# EAGLE design TPS22810_breakout (EAGLE 6.6.0)
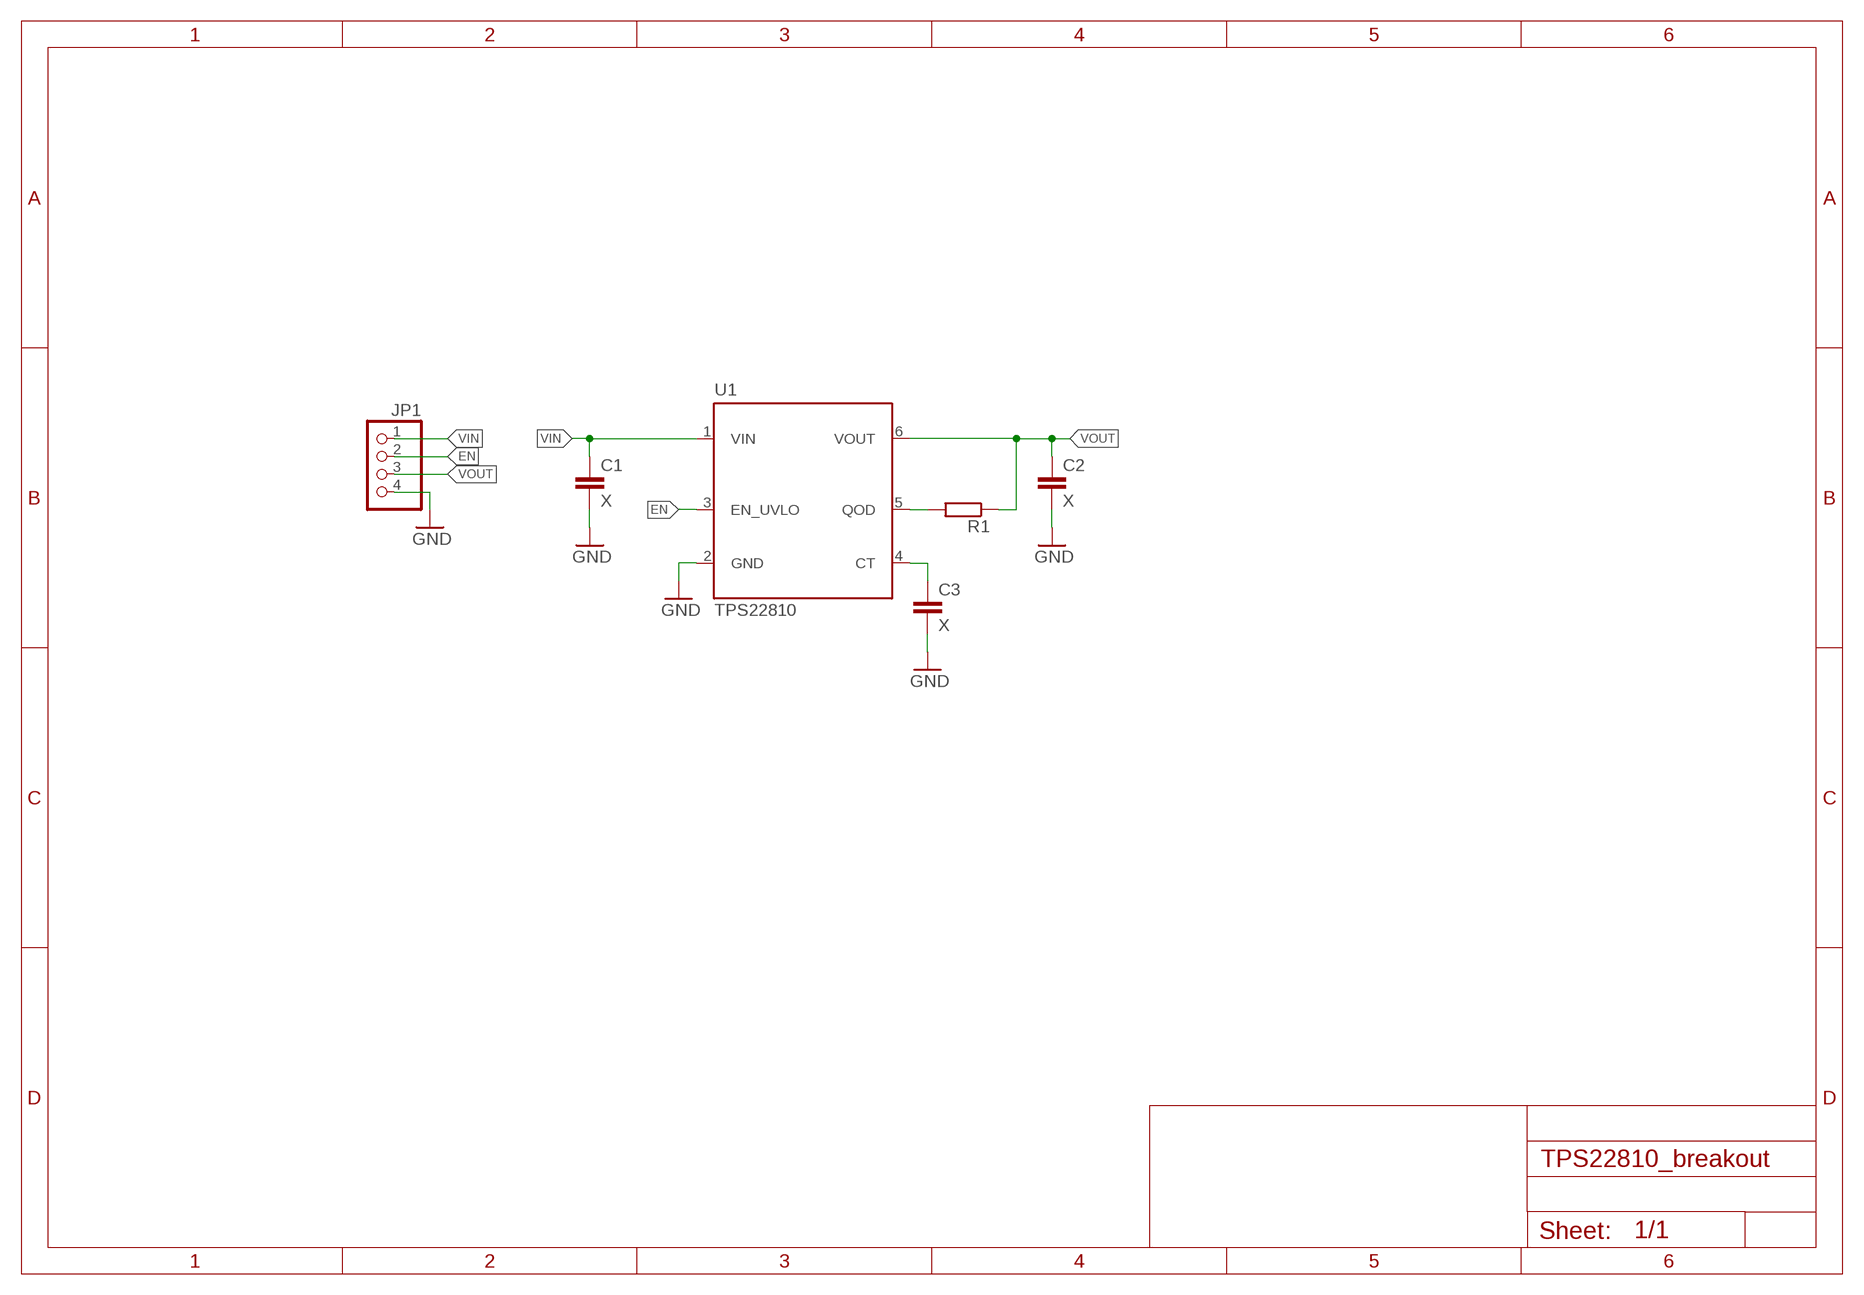
[diagram p0: schematic, sheet 1]

## Parts
C1  X  C-EU0603  [C0603]
C2  X  C-EU0603  [C0603]
C3  X  C-EU0603  [C0603]
JP1  PINHD-1X4  [1X04]
R1  R-EU_R0603  [R0603]
U1  TPS22810  [DBV-R-PDSO-G6]

## Nets
EN: JP1.2 U1.3(EN_UVLO)
GND: C1.2 C2.2 C3.2 JP1.4 U1.2(GND)
N$2: R1.2 U1.5(QOD)
N$3: C3.1 U1.4(CT)
VIN: C1.1 JP1.1 U1.1(VIN)
VOUT: C2.1 JP1.3 R1.1 U1.6(VOUT)

## Library data of the parts
C1-C3 = usr_gerneral:C-EU; DISTRIBUTOR: Digikey; OC_DIGIKEY: 445-7368-1-ND; ORDER_CODE: 445-7368-1-ND
JP1 = pinhead:PINHD-1X4: PIN HEADER
R1 = rcl:R-EU_: RESISTOR, European symbol
U1 = usr_TexasInstruments:TPS22810: 2.7-18-V, 2-A, 79-mΩ On-Resistance Load Switch with Thermal Protection; DISTRIBUTOR: Digikey; OC_DIGIKEY: 296-45304-1-ND; ORDER_CODE: 296-45304-1-ND

## Board
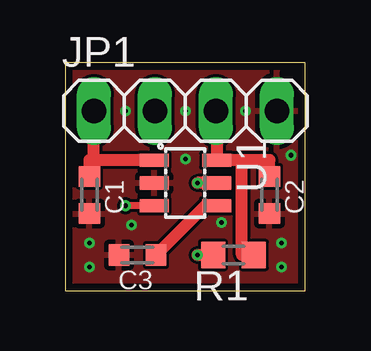
[diagram p1: board, top side]
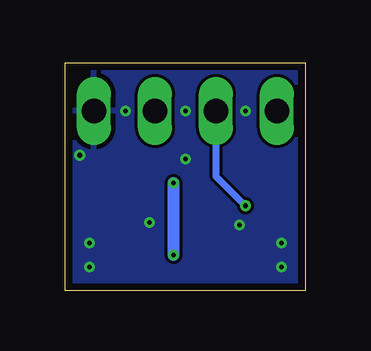
[diagram p2: board, bottom side, seen from below]

Size 10 x 9.5 mm. Coordinates in mm from the lower left corner, seen from the top.
Outline: 0,0 10,0 10,9.5 0,9.5 0,0
Copper layers (1*16): Top 0.035mm / dielectric 1.5mm / Bottom 0.035mm
Design rules "PCB-POOL HighSpec": minimum track width 0.125mm, minimum drill 0.2mm, track to track 0.125mm, track to pad 0.125mm, pad to pad 0.125mm, via to via 0.125mm, smd to smd 0mil, copper to edge 0.3mm, drill to drill 0.2mm, minimum pad ring 0.2mm, minimum via ring 0.125mm, stop-mask expansion 0.075mm, vias tented up to drill 0.5mm, thermal gap 0.2mm

### Footprints (pad centres in the part's own frame; a part is rotated, then mirrored left to right if it is on the bottom)
C0603 = smd 0.85 x 0.9: 1 -0.775,0; 2 0.775,0
1X04 = drill 1.016 long: 1 -3.81,0; 2 -1.27,0; 3 1.27,0; 4 3.81,0
R0603 = smd 1 x 1.1: 1 -0.85,0; 2 0.85,0
DBV-R-PDSO-G6 = smd 0.55 x 1.2: 1 -0.95,-1.3; 2 0,-1.3; 3 0.95,-1.3; 4 0.95,1.3; 5 0,1.3; 6 -0.95,1.3

### Placement (x,y rotation side)
C1  1,4 270 top
C2  8.5,4 270 top
C3  3,1.5 180 top
JP1  5,7.5 0 top
R1  7,1.5 180 top
U1  5,4.5 270 top

### Tracks (layer width: path | path; a pad name or v marks a point on that pad's centre or on a via)
EN  (via drill 0.2)
  Top 0.3: U1.3 3.55,3.55 3.5,3.5 3.65,3.5 U1.3 | U1.3 v2.5,3.55
  Bottom 0.3: JP1.2 3.73,4.78 v2.5,3.55
GND  (via drill 0.2)
  other vias: 5,5.5 1,2 2.75,2.75 6.5,2.85 1,1 9,1 9,2 9.4,5.65 2.5,7.5 5,7.5 7.5,7.5
  pour Top: -0.5,-0.5 10.5,-0.5 10.5,10 -0.5,10
  pour Bottom: -1,-1 11,-1 11,10.5 -1,10.5
N$2  (via drill 0.2)
  Top 0.5: U1.5 v5.5,4.5 | v5.5,1.5 R1.2
  Bottom 0.5: v5.5,4.5 v5.5,1.5
N$3
  Top 0.5: U1.4 5.83,3.55 C3.1
VIN
  Top 0.5: U1.1 1.19,5.45 | 1.19,5.45 JP1.1 | 1.19,5.45 1,5.45 C1.1
VOUT
  Top 0.5: JP1.3 6.3,7.5 U1.6 7.35,5.45 | C2.1 8.5,5.45 7.35,5.45 | R1.1 7.35,1.5 7.35,5.45